# EasyEDA Pro project ProPrj_SCH_SnailCard底板_2025-01-03_23-10-43_2025-01-31.epro, schematic SnailCard 3底板
Board Name: SnailCard 3底板; Create Date: 2025-01-03; Page Name: Sheet_1; Project Name: SCH_SnailCard底板_2025-01-03_23-10-43; Schematic Name: SnailCard 3底板; Update Date: 2025-01-04; Company: 嘉立创EDA; Page Size: A2; Version: V1.0
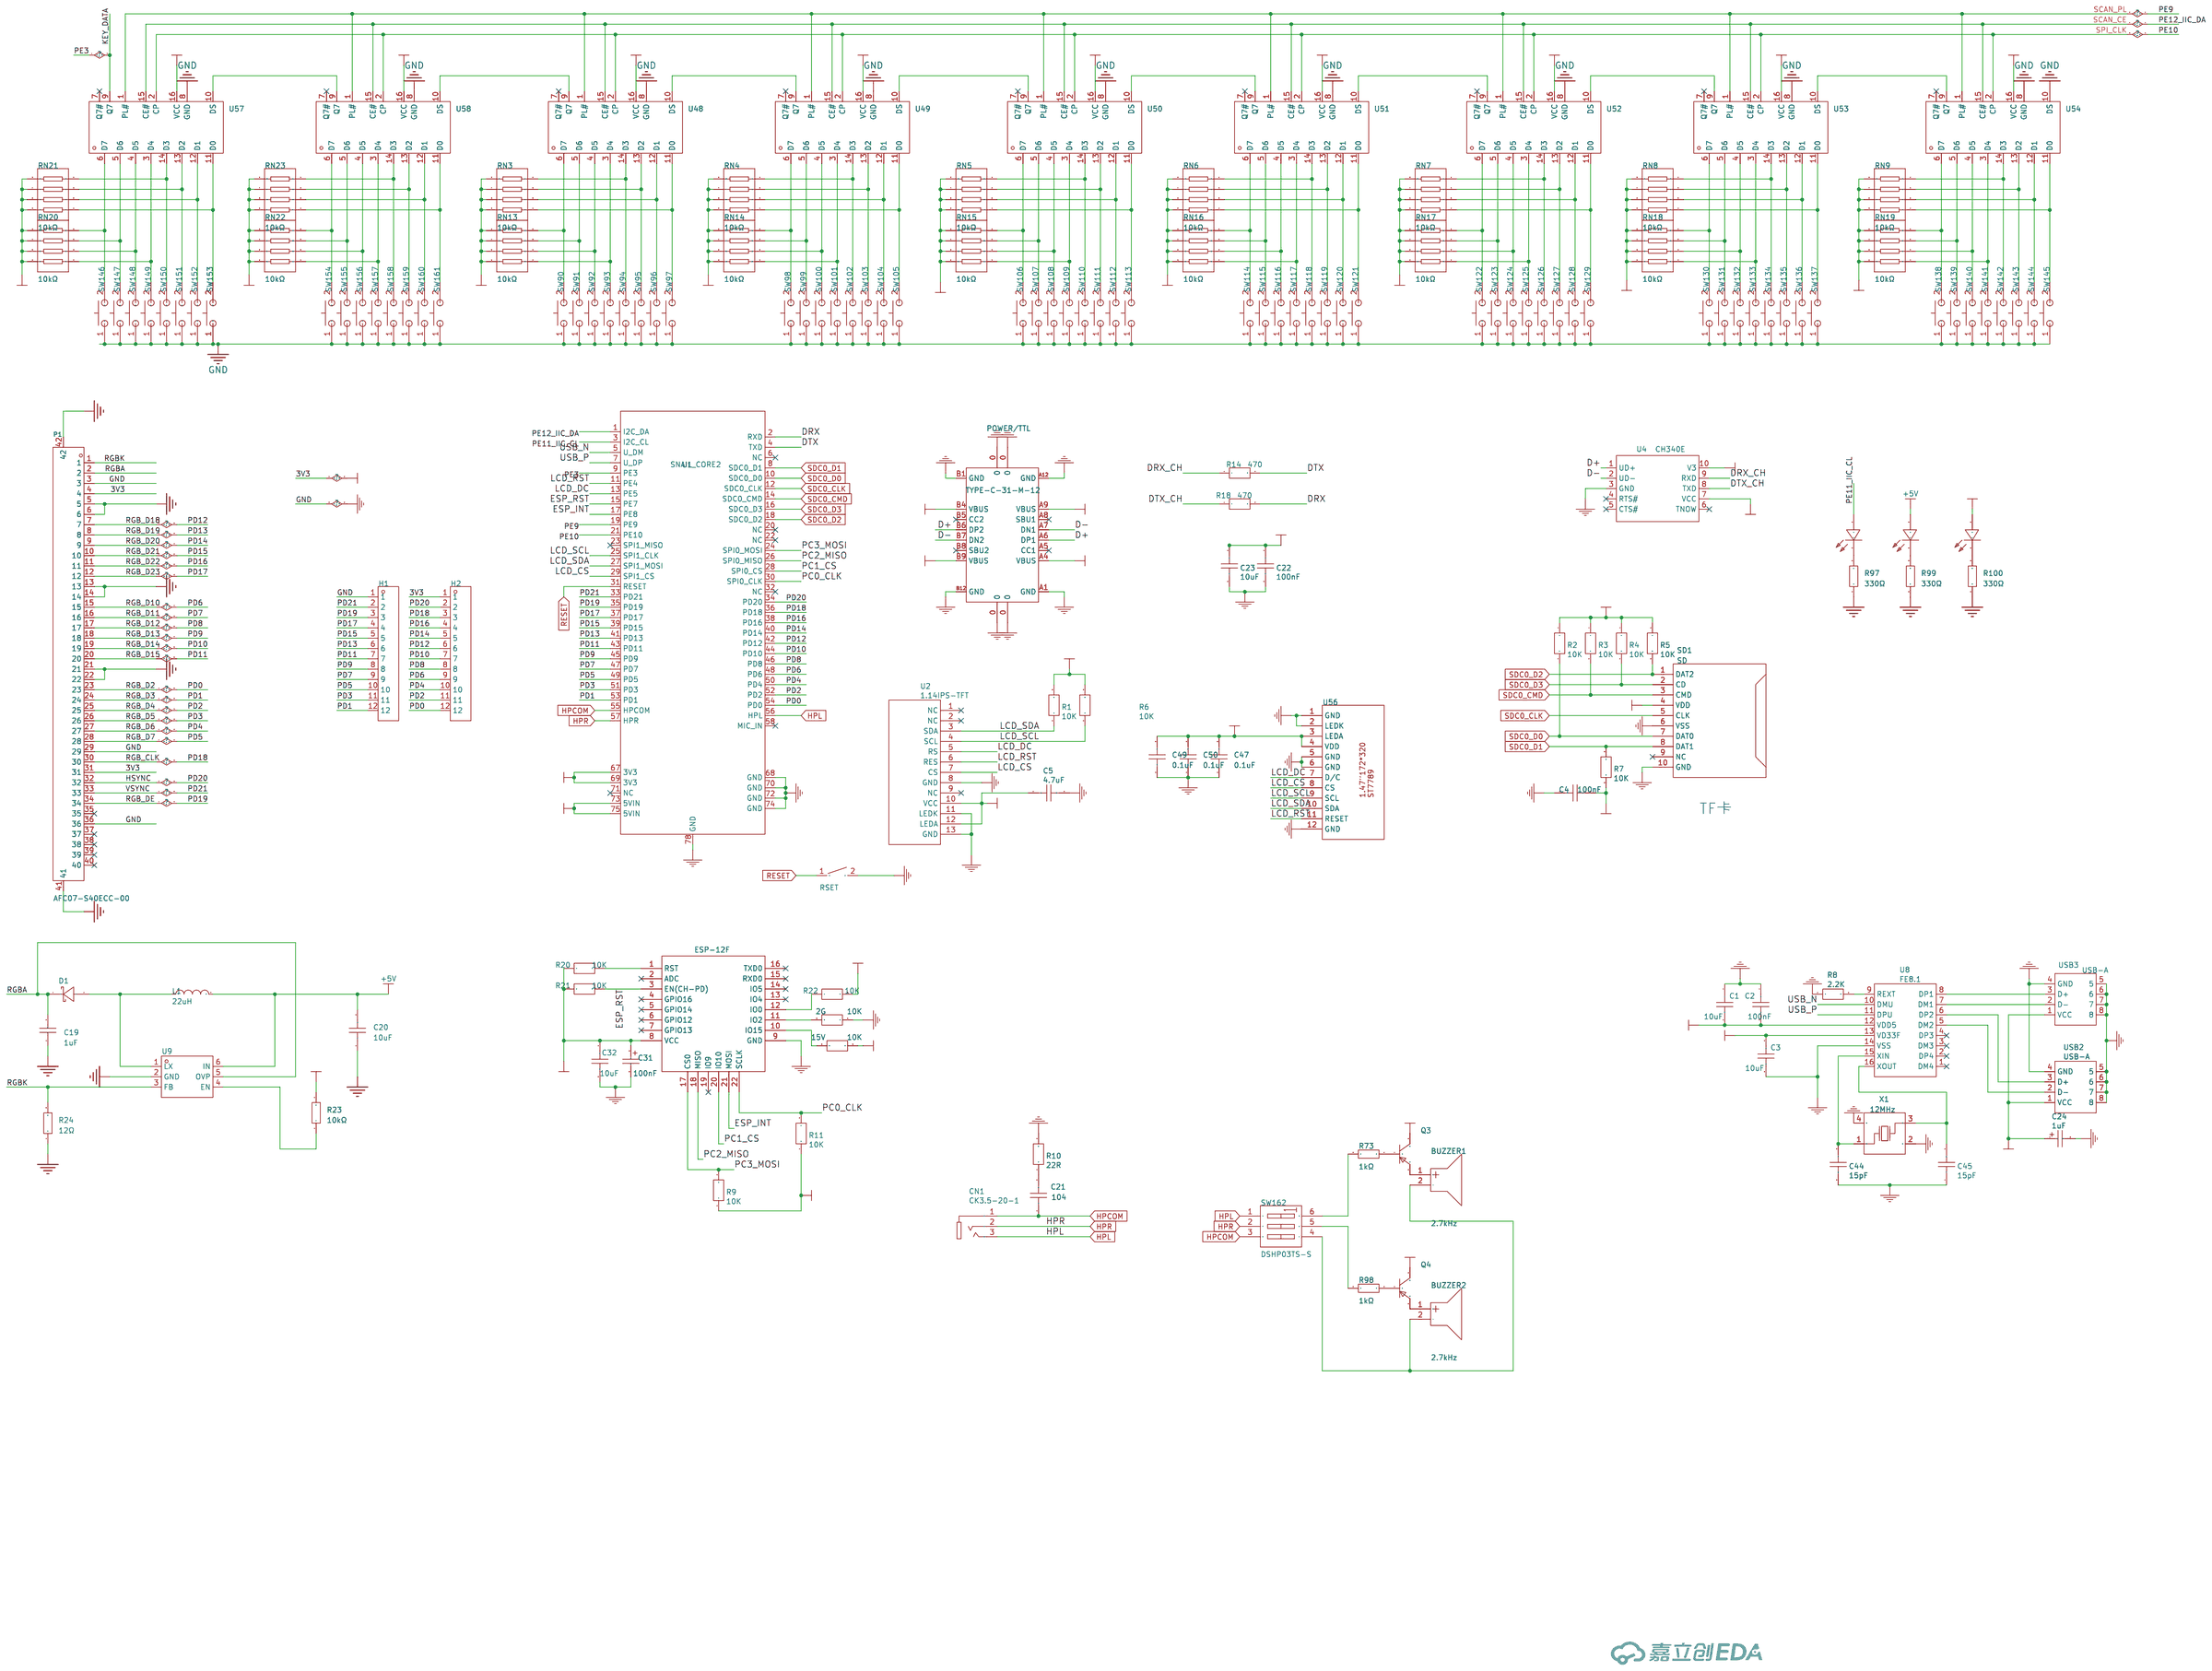
[diagram p0: schematic sheet]

## Parts
2G  10K  [R0603]
15V  10K  [R0603]
BUZZER1  2.7kHz  [BUZ-TH_BD9.0-P5.00-D0.6-FD]
BUZZER2  2.7kHz  [BUZ-TH_BD9.0-P5.00-D0.6-FD]
C1  10uF  [C0603]
C2  100nF  [C0603]
C3  10uF  [C0603]
C4  100nF  [C0603]
C5  4.7uF  [C0603]
C19  1uF  [C0603]
C20  10uF  [C0603]
C21  104  [C0603]
C22  100nF  [C0603]
C23  10uF  [C0603]
C24  1uF  [CAP-SMD_L3.5-W2.8-R-RD]
C31  100nF  [CAP-SMD_L3.5-W2.8-R-RD]
C32  10uF  [C0603]
C44  15pF  [C0603]
C45  15pF  [C0603]
C47  0.1uF  [C0603]
C49  0.1uF  [C0603]
C50  0.1uF  [C0603]
CN1  CK3.5-20-1  [AUDIO-SMD_CK3.5-20-1]
D1  -  [SMA_L4.3-W2.5-LS5.0-RD]
H1  -  [HDR-TH_12P-P2.54-V-M]
H2  -  [HDR-TH_12P-P2.54-V-M]
L1  22uH  [IND-SMD_L4.5-W4.0_SM4532]
LED96  KT-0805G  [LED0805-R-RD]
LED97  KT-0805G  [LED0805-R-RD]
LED98  KT-0805G  [LED0805-R-RD]
P1  AFC07-S40ECC-00  [CONN-SMD_AFC07-S40ECC-00]
POWER/TTL  TYPE-C-31-M-12  [USB-C_SMD-TYPE-C-31-M-12]
Q3  S8550  [SOT-23-3_L2.9-W1.3-P1.90-LS2.4-BR]
Q4  S8550  [SOT-23-3_L2.9-W1.3-P1.90-LS2.4-BR]
R1  10K  [R0603]
R2  10K  [R0603]
R3  10K  [R0603]
R4  10K  [R0603]
R5  10K  [R0603]
R6  10K  [R0603]
R7  10K  [R0603]
R8  2.2K  [R0603]
R9  10K  [R0603]
R10  22R  [R0603]
R11  10K  [R0603]
R14  470  [R0603]
R18  470  [R0603]
R20  10K  [R0603]
R21  10K  [R0603]
R22  10K  [R0603]
R23  10kΩ  [R0603]
R24  12Ω  [R0603]
R73  1kΩ  [R0603]
R97  330Ω  [R0603]
R98  1kΩ  [R0603]
R99  330Ω  [R0603]
R100  330Ω  [R0603]
RN3  10kΩ  [RES-ARRAY-SMD_0603-8P-L3.2-W1.6-BL]
RN4  10kΩ  [RES-ARRAY-SMD_0603-8P-L3.2-W1.6-BL]
RN5  10kΩ  [RES-ARRAY-SMD_0603-8P-L3.2-W1.6-BL]
RN6  10kΩ  [RES-ARRAY-SMD_0603-8P-L3.2-W1.6-BL]
RN7  10kΩ  [RES-ARRAY-SMD_0603-8P-L3.2-W1.6-BL]
RN8  10kΩ  [RES-ARRAY-SMD_0603-8P-L3.2-W1.6-BL]
RN9  10kΩ  [RES-ARRAY-SMD_0603-8P-L3.2-W1.6-BL]
RN13  10kΩ  [RES-ARRAY-SMD_0603-8P-L3.2-W1.6-BL]
RN14  10kΩ  [RES-ARRAY-SMD_0603-8P-L3.2-W1.6-BL]
RN15  10kΩ  [RES-ARRAY-SMD_0603-8P-L3.2-W1.6-BL]
RN16  10kΩ  [RES-ARRAY-SMD_0603-8P-L3.2-W1.6-BL]
RN17  10kΩ  [RES-ARRAY-SMD_0603-8P-L3.2-W1.6-BL]
RN18  10kΩ  [RES-ARRAY-SMD_0603-8P-L3.2-W1.6-BL]
RN19  10kΩ  [RES-ARRAY-SMD_0603-8P-L3.2-W1.6-BL]
RN20  10kΩ  [RES-ARRAY-SMD_0603-8P-L3.2-W1.6-BL]
RN21  10kΩ  [RES-ARRAY-SMD_0603-8P-L3.2-W1.6-BL]
RN22  10kΩ  [RES-ARRAY-SMD_0603-8P-L3.2-W1.6-BL]
RN23  10kΩ  [RES-ARRAY-SMD_0603-8P-L3.2-W1.6-BL]
RSET  ST-1185S  [SW-SMD_ST-1185S]
SD1  SD  [TF-SMD_TF-115K]
SW90  -  [SW-SMD_L3.9-W2.9-P4.15-LS5.0]
SW91  -  [SW-SMD_L3.9-W2.9-P4.15-LS5.0]
SW92  -  [SW-SMD_L3.9-W2.9-P4.15-LS5.0]
SW93  -  [SW-SMD_L3.9-W2.9-P4.15-LS5.0]
SW94  -  [SW-SMD_L3.9-W2.9-P4.15-LS5.0]
SW95  -  [SW-SMD_L3.9-W2.9-P4.15-LS5.0]
SW96  -  [SW-SMD_L3.9-W2.9-P4.15-LS5.0]
SW97  -  [SW-SMD_L3.9-W2.9-P4.15-LS5.0]
SW98  -  [SW-SMD_L3.9-W2.9-P4.15-LS5.0]
SW99  -  [SW-SMD_L3.9-W2.9-P4.15-LS5.0]
SW100  -  [SW-SMD_L3.9-W2.9-P4.15-LS5.0]
SW101  -  [SW-SMD_L3.9-W2.9-P4.15-LS5.0]
SW102  -  [SW-SMD_L3.9-W2.9-P4.15-LS5.0]
SW103  -  [SW-SMD_L3.9-W2.9-P4.15-LS5.0]
SW104  -  [SW-SMD_L3.9-W2.9-P4.15-LS5.0]
SW105  -  [SW-SMD_L3.9-W2.9-P4.15-LS5.0]
SW106  -  [SW-SMD_L3.9-W2.9-P4.15-LS5.0]
SW107  -  [SW-SMD_L3.9-W2.9-P4.15-LS5.0]
SW108  -  [SW-SMD_L3.9-W2.9-P4.15-LS5.0]
SW109  -  [SW-SMD_L3.9-W2.9-P4.15-LS5.0]
SW110  -  [SW-SMD_L3.9-W2.9-P4.15-LS5.0]
SW111  -  [SW-SMD_L3.9-W2.9-P4.15-LS5.0]
SW112  -  [SW-SMD_L3.9-W2.9-P4.15-LS5.0]
SW113  -  [SW-SMD_L3.9-W2.9-P4.15-LS5.0]
SW114  -  [SW-SMD_L3.9-W2.9-P4.15-LS5.0]
SW115  -  [SW-SMD_L3.9-W2.9-P4.15-LS5.0]
SW116  -  [SW-SMD_L3.9-W2.9-P4.15-LS5.0]
SW117  -  [SW-SMD_L3.9-W2.9-P4.15-LS5.0]
SW118  -  [SW-SMD_L3.9-W2.9-P4.15-LS5.0]
SW119  -  [SW-SMD_L3.9-W2.9-P4.15-LS5.0]
SW120  -  [SW-SMD_L3.9-W2.9-P4.15-LS5.0]
SW121  -  [SW-SMD_L3.9-W2.9-P4.15-LS5.0]
SW122  -  [SW-SMD_L3.9-W2.9-P4.15-LS5.0]
SW123  -  [SW-SMD_L3.9-W2.9-P4.15-LS5.0]
SW124  -  [SW-SMD_L3.9-W2.9-P4.15-LS5.0]
SW125  -  [SW-SMD_L3.9-W2.9-P4.15-LS5.0]
SW126  -  [SW-SMD_L3.9-W2.9-P4.15-LS5.0]
SW127  -  [SW-SMD_L3.9-W2.9-P4.15-LS5.0]
SW128  -  [SW-SMD_L3.9-W2.9-P4.15-LS5.0]
SW129  -  [SW-SMD_L3.9-W2.9-P4.15-LS5.0]
SW130  -  [SW-SMD_L3.9-W2.9-P4.15-LS5.0]
SW131  -  [SW-SMD_L3.9-W2.9-P4.15-LS5.0]
SW132  -  [SW-SMD_L3.9-W2.9-P4.15-LS5.0]
SW133  -  [SW-SMD_L3.9-W2.9-P4.15-LS5.0]
SW134  -  [SW-SMD_L3.9-W2.9-P4.15-LS5.0]
SW135  -  [SW-SMD_L3.9-W2.9-P4.15-LS5.0]
SW136  -  [SW-SMD_L3.9-W2.9-P4.15-LS5.0]
SW137  -  [SW-SMD_L3.9-W2.9-P4.15-LS5.0]
SW138  -  [SW-SMD_L3.9-W2.9-P4.15-LS5.0]
SW139  -  [SW-SMD_L3.9-W2.9-P4.15-LS5.0]
SW140  -  [SW-SMD_L3.9-W2.9-P4.15-LS5.0]
SW141  -  [SW-SMD_L3.9-W2.9-P4.15-LS5.0]
SW142  -  [SW-SMD_L3.9-W2.9-P4.15-LS5.0]
SW143  -  [SW-SMD_L3.9-W2.9-P4.15-LS5.0]
SW144  -  [SW-SMD_L3.9-W2.9-P4.15-LS5.0]
SW145  -  [SW-SMD_L3.9-W2.9-P4.15-LS5.0]
SW146  -  [SW-SMD_L3.9-W2.9-P4.15-LS5.0]
SW147  -  [SW-SMD_L3.9-W2.9-P4.15-LS5.0]
SW148  -  [SW-SMD_L3.9-W2.9-P4.15-LS5.0]
SW149  -  [SW-SMD_L3.9-W2.9-P4.15-LS5.0]
SW150  -  [SW-SMD_L3.9-W2.9-P4.15-LS5.0]
SW151  -  [SW-SMD_L3.9-W2.9-P4.15-LS5.0]
SW152  -  [SW-SMD_L3.9-W2.9-P4.15-LS5.0]
SW153  -  [SW-SMD_L3.9-W2.9-P4.15-LS5.0]
SW154  -  [SW-SMD_L3.9-W2.9-P4.15-LS5.0]
SW155  -  [SW-SMD_L3.9-W2.9-P4.15-LS5.0]
SW156  -  [SW-SMD_L3.9-W2.9-P4.15-LS5.0]
SW157  -  [SW-SMD_L3.9-W2.9-P4.15-LS5.0]
SW158  -  [SW-SMD_L3.9-W2.9-P4.15-LS5.0]
SW159  -  [SW-SMD_L3.9-W2.9-P4.15-LS5.0]
SW160  -  [SW-SMD_L3.9-W2.9-P4.15-LS5.0]
SW161  -  [SW-SMD_L3.9-W2.9-P4.15-LS5.0]
SW162  DSHP03TS-S  [SW-SMD_DSHP03TS-S]
U1  SNAIL_CORE2  [SNAIL_CORE2]
U2  1.14IPS-TFT  [1.14IPS]
U3  ESP-12F  [WIFIM-SMD_ESP-12F-ESP8266MOD]
U4  CH340E  [MSOP-10_L3.0-W3.0-P0.50-LS5.0-BL]
U8  FE8.1  [SSOP-16_L4.9-W3.9-P0.64-LS6.0-BL]
U9  RY3730  [SOT-23-6_L2.9-W1.6-P0.95-LS2.8-BL]
U48  -  [SOIC-16_L9.9-W3.9-P1.27-LS6.0-BL]
U49  -  [SOIC-16_L9.9-W3.9-P1.27-LS6.0-BL]
U50  -  [SOIC-16_L9.9-W3.9-P1.27-LS6.0-BL]
U51  -  [SOIC-16_L9.9-W3.9-P1.27-LS6.0-BL]
U52  -  [SOIC-16_L9.9-W3.9-P1.27-LS6.0-BL]
U53  -  [SOIC-16_L9.9-W3.9-P1.27-LS6.0-BL]
U54  -  [SOIC-16_L9.9-W3.9-P1.27-LS6.0-BL]
U56  -  [1.47''173*320 ST7789]
U57  -  [SOIC-16_L9.9-W3.9-P1.27-LS6.0-BL]
U58  -  [SOIC-16_L9.9-W3.9-P1.27-LS6.0-BL]
USB2  USB-A  [USB-A]
USB3  USB-A  [USB-A]
X1  12MHz  [OSC-SMD_4P-L3.2-W2.5-BL]

## Library data of the parts
2G 15V R1-R7 R9 R11 R20-R22 = 10K: Supplier: LCSC; Supplier Part: C465746; Manufacturer: PANASONIC; Manufacturer Part: ERA3ARB103V; JLCPCB Part Class: Extended Part
BUZZER1 BUZZER2 = GMD0955YB-3V2700: 驱动方式:有源(内含驱动线路);构造类型:电磁式;频率:2.7kHz;声压(SPL):80dB@3V,10cm;; Supplier Part: C252933; Manufacturer: INGHAi(赢海); JLCPCB Part Class: Extended Part; Datasheet: https://atta.szlcsc.com/upload/public/pdf/source/20200113/C252933_0808B968C54230937A04AB87C18560D6.pdf; Supplier: LCSC; Oscillator Circuit: 有源(内含驱动线路); Technology Type: 电磁式; Operating Voltage: 2V~5V; Sound Pressure Level (SPL): 80dB@3V,10cm; Diameter (φD): 9mm; Height: 5.5mm
C1 C3 C23 C32 = 10uF: Supplier: LCSC; Supplier Part: C524952; Manufacturer: Taiyo Yuden; Manufacturer Part: AMK107BJ106MA-T
C2 C4 C22 = 100nF: Supplier: LCSC; Supplier Part: C524952; Manufacturer: Taiyo Yuden; Manufacturer Part: AMK107BJ106MA-T
C5 C47 C49 C50 = 4.7uF: Supplier: LCSC; Supplier Part: C524952; Manufacturer: Taiyo Yuden; Manufacturer Part: AMK107BJ106MA-T
C19 = CL10A105KB8NNNC: 容值:1uF;精度:±10%;额定电压:50V;材质(温度系数):X5R;; LCSC Part Name: 1uF ±10% 50V; Supplier Part: C15849; Manufacturer: SAMSUNG(三星); Supplier Footprint: 0603; JLCPCB Part Class: Basic Part; Datasheet: https://atta.szlcsc.com/upload/public/pdf/source/20160103/1457707679084.pdf; Supplier: LCSC; Tolerance: ±10%; Voltage Rated: 50V; Temperature Coefficient: X5R
C20 = CL10A106KP8NNNC: 容值:10uF;精度:±10%;额定电压:10V;材质(温度系数):X5R;; LCSC Part Name: 10uF ±10% 10V; Supplier Part: C19702; Manufacturer: SAMSUNG(三星); Supplier Footprint: 0603; JLCPCB Part Class: Basic Part; Datasheet: https://atta.szlcsc.com/upload/public/pdf/source/20160103/1457707703378.pdf; Supplier: LCSC; Tolerance: ±10%; Voltage Rated: 10V; Temperature Coefficient: X5R
C21 = 104
C24 = 1uF: Supplier: LCSC; Manufacturer: AVX; Manufacturer Part: TAJB105K035RNJ; Supplier Part: C7192; JLCPCB Part Class: Extend; JLCPCB SMD: Yes
C31 = 100nF: Supplier: LCSC; Manufacturer: AVX; Manufacturer Part: TAJB105K035RNJ; Supplier Part: C7192; JLCPCB Part Class: Extend; JLCPCB SMD: Yes
C44 C45 = 15pF
CN1 = CK3.5-20-1: Supplier: LCSC; Supplier Part: C718046; Manufacturer: JINJIA
D1 = SS34: 二极管配置:独立式;直流反向耐压(Vr):45V;平均整流电流(Io):3A;正向压降(Vf):550mV@3A;反向电流(Ir):500A@45V;; LCSC Part Name: 45V 3A 550mV@3A; Supplier Part: C2900685; Manufacturer: BLUE ROCKET(蓝箭); Supplier Footprint: SMA; JLCPCB Part Class: Extended Part; Datasheet: https://atta.szlcsc.com/upload/public/pdf/source/20211019/D690381062792463711EAF5143529E57.pdf; Supplier: LCSC; Diode Configuration: 独立式; Reverse Voltage (Vr): 45V; Average Rectified Current (Io): 3A; Forward Voltage (Vf@If): 550mV@3A; Reverse Leakage Current (Ir): 500A@45V
H1 H2 = HDR-M_2.54_1x12P: 间距:2.54mm;总PIN位数:12;排数:1;插针结构:1x12P;行距:-;安装类型:直插;圆针/方针:方针;额定电流:3A;额定电压:250V;配合针长度:6mm;塑高:2.5mm;端接针长度:3mm;触头材质:-;工作温度范围:-40℃~+105℃;颜色:黑色;; Supplier Part: C2840012; Supplier Footprint: 插件
L1 = GCD43-220MC: 电感值:22uH;精度:±20%;额定电流:1A;直流电阻(DCR):375mΩ;; LCSC Part Name: 22uH ±20% 1A 375mΩ; Supplier Part: C439244; Manufacturer: GLE(格莱尔); Supplier Footprint: SMD; JLCPCB Part Class: Extended Part; Datasheet: https://atta.szlcsc.com/upload/public/pdf/source/20191226/C439244_68427D11A7C3652EC048C5CEB2B3AA76.pdf; Supplier: LCSC; Tolerance: ±20%; Rated Current: 1A; DC Resistance (DCR): 375mΩ
LED96-LED98 = KT-0805G: 灯头类型:-;发光颜色:翠绿色;正向电压(VF):-;功率:-;正向电流:-;主波长:-;二极管配置:-;透镜颜色:-;色温:-;发光强度:-;发光角度:-;载带方式:-;工作温度:-;; LCSC Part Name: 0805 翠绿 高亮; Supplier Part: C2297; Manufacturer: KENTO; Supplier Footprint: 0805; JLCPCB Part Class: 基础库; Datasheet: https://atta.szlcsc.com/upload/public/pdf/source/20170209/1486607340485.pdf; Supplier: LCSC; Emitted Color: 翠绿色
P1 = AFC07-S40ECC-00: 间距:0.5mm;触点数量:40P;锁定特性:抽屉式;安装类型:卧贴;触点类型:上接;; LCSC Part Name: 0.5mm P数:40P 抽屉式 上接; Supplier Part: C11097; Manufacturer: JS(钜硕电子); Supplier Footprint: SMD,P=0.5mm; JLCPCB Part Class: Extended Part; Datasheet: https://atta.szlcsc.com/upload/public/pdf/source/20130129/1457706582878.pdf; Supplier: LCSC; Pitch: 0.5mm; Number of Contacts: 40P; Locking Feature: 抽屉式; Mounting Type: 卧贴; Contact Type: 上接; Height Above Board: 2mm; FFC, FCB Thickness: 0.3mm
POWER/TTL = TYPE-C-31-M-12: Supplier: LCSC; Supplier Part: C165948; Manufacturer: Rectangular Connectors - Contacts
Q3 Q4 = S8550_C2891805: Supplier Part: C2891805; Manufacturer: YONGYUTAI(永裕泰); Supplier Footprint: SOT-23; JLCPCB Part Class: 扩展库; Datasheet: https://atta.szlcsc.com/upload/public/pdf/source/20210901/65C3C4D1695A9271DEFEFE0B623CB3B1.pdf; Supplier: LCSC
R8 = 2.2K: Supplier: LCSC; Supplier Part: C465746; Manufacturer: PANASONIC; Manufacturer Part: ERA3ARB103V; JLCPCB Part Class: Extended Part
R10 = 22R
R14 R18 = 470: Supplier: LCSC; Supplier Part: C465746; Manufacturer: PANASONIC; Manufacturer Part: ERA3ARB103V; JLCPCB Part Class: Extended Part
R23 = 0603WAF1002T5E: 阻值:10kΩ;精度:±1%;功率:100mW;温度系数:±100ppm/℃;电阻类型:厚膜电阻;; LCSC Part Name: 10kΩ ±1% 100mW 厚膜电阻; Supplier Part: C25804; Manufacturer: UNI-ROYAL(厚声); Supplier Footprint: 0603; JLCPCB Part Class: Basic Part; Datasheet: https://atta.szlcsc.com/upload/public/pdf/source/20200306/C422600_1E6D84923E4A46A82E41ADD87F860B5C.pdf; Supplier: LCSC; Tolerance: ±1%; Power(Watts): 100mW; Overload Voltage (Max): 75V; Temperature Coefficient: ±100ppm/℃; Type: 厚膜电阻; Operating Temperature Range: -55℃~+155℃
R24 = RS-03K12R0FT: 阻值:12Ω;精度:±1%;功率:100mW;温度系数:±100ppm/℃;; LCSC Part Name: 12Ω ±1% 100mW; Supplier Part: C310268; Manufacturer: FH(风华); Supplier Footprint: 0603; JLCPCB Part Class: Extended Part; Datasheet: https://atta.szlcsc.com/upload/public/pdf/source/20180927/C310268_81D91F4EFBEFB660CE5EA636240332E4.pdf; Supplier: LCSC; Tolerance: ±1%; Power(Watts): 100mW; Temperature Coefficient: ±100ppm/℃; Overload Voltage (Max): 50V; Operating Temperature Range: -55℃~+155℃
R73 R98 = 0603WAF1001T5E: 电阻类型:厚膜电阻;阻值:1kΩ;精度:±1%;功率:100mW;; LCSC Part Name: 1kΩ ±1% 100mW; Supplier Part: C21190; Manufacturer: UNI-ROYAL(厚声); Supplier Footprint: 0603; JLCPCB Part Class: Basic Part; Datasheet: https://atta.szlcsc.com/upload/public/pdf/source/20200306/C422600_1E6D84923E4A46A82E41ADD87F860B5C.pdf; Supplier: LCSC; Type: 厚膜电阻; Tolerance: ±1%; Power(Watts): 100mW; Temperature Coefficient: ±100ppm/℃; Overload Voltage (Max): 75V; Operating Temperature Range: -55℃~+155℃
R97 R99 R100 = 0603WAF3300T5E: 电阻类型:厚膜电阻;阻值:330Ω;精度:±1%;功率:100mW;最大工作电压:75V;温度系数:±100ppm/℃;; LCSC Part Name: 330Ω ±1% 100mW 厚膜电阻; Supplier Part: C23138; Manufacturer: UNI-ROYAL(厚声); Supplier Footprint: 0603; JLCPCB Part Class: 基础库; Datasheet: https://atta.szlcsc.com/upload/public/pdf/source/20200306/C422600_1E6D84923E4A46A82E41ADD87F860B5C.pdf; Supplier: LCSC; Type: 厚膜电阻; Tolerance: ±1%; Power(Watts): 100mW; Overload Voltage (Max): 75V; Temperature Coefficient: ±100ppm/℃; Operating Temperature Range: -55℃~+155℃
RN3-RN9 RN13-RN23 = 4D03WGJ0103T5E: 阻值:10kΩ;精度:±5%;单个元件功率:62.5mW;温度系数:±200ppm/;电阻器数:4;引脚数:8;; LCSC Part Name: 10kΩ ±5%; Supplier Part: C29718; Manufacturer: UNI-ROYAL(厚声); Supplier Footprint: 0603x4; Datasheet: https://atta.szlcsc.com/upload/public/pdf/source/20170615/1497511005633.pdf; Supplier: LCSC; Tolerance: ±5%; Power(Watts): 62.5mW; Temperature Coefficient: ±200ppm/; Number of Resistors: 4; Number of Pins: 8
RSET = ST-1185S: Supplier: LCSC; Supplier Part: C589191; Manufacturer: RI SHENG; JLCPCB Part Class: Extended Part
SD1 = SD
SW90-SW161 = GT-TC029B-H025-L1N: 触点电流:50mA;额定电压(DC):12V;绝缘电阻:100MΩ;电路结构:单刀单掷;安装方式:立贴;按钮形状:圆形按钮;按钮/盖帽颜色:黑色;带灯:无;作用力:250gf@±30gf;机械寿命:100000;工作温度:-30℃~+85℃;引脚样式:SMD接片;开关长度:3.9mm;开关宽度:2.9mm;开关高度:2.5mm;带支架:否;; LCSC Part Name: 立式两脚小龟H2.5 250gf 无柱; Supplier Part: C843669; Manufacturer: G-Switch(品赞); Supplier Footprint: SMD,3×4×2.5mm; JLCPCB Part Class: Extended Part; Datasheet: https://atta.szlcsc.com/upload/public/pdf/source/20201014/C843665_B07D254A2E90B746498E934B945CCD5F.pdf; Supplier: LCSC; Contact Current: 50mA; Voltage Rating (DC): 12V; Insulation Resistance: 100MΩ; Circuit: 单刀单掷; Mounting Style: 立贴; Actuator Style: 圆形按钮; Actuator/Cap Color: 黑色; With Lamp: 无; Operating Force: 250gf@±30gf; Mechanical Life: 100000; Operating Temperature: -30℃~+85℃; Pin Style: SMD接片; Switch Length: 3.9mm; Switch Width: 2.9mm; Switch Height: 2.5mm; Strike Gundam: 否
SW162 = DSHP03TS-S: 类型:平拨,凹槽式;电路结构:单刀单掷;开关位数:3位;额定电流:25mA;额定电压:24V;使用寿命:3千次;颜色:黑色;; LCSC Part Name: 间距1.27mm 平拨,凹槽式 3位拨码开关; Supplier Part: C319051; Manufacturer: XKB Connectivity(中国星坤); Supplier Footprint: SMD-6P,5.4x5.4mm; JLCPCB Part Class: Extended Part; Datasheet: https://atta.szlcsc.com/upload/public/pdf/source/20211009/11BE85C99D2C85B0991AF4F9D6EB8BDE.pdf; Supplier: LCSC; Type: 平拨,凹槽式; Circuit: 单刀单掷; Number of Positions: 3位; Pin Style: 鸥翼型; Lead Pitch: 1.27mm; Current Rating: 25mA; Voltage Rating: 24V; Operating Temperature: -20℃~+70℃; Operating Life: 3千次; Color: 黑色
U1 = SNAIL_CORE2
U2 = 1.14IPS-TFT
U3 = ESP-12F: Supplier: LCSC; Manufacturer: Ai-Thinker; Manufacturer Part: ESP-12F(ESP8266MOD); Supplier Part: C82891
U4 = CH340E: Supplier: LCSC; Manufacturer: WCH; Supplier Part: C99652; JLCPCB Part Class: Extend
U8 = FE8.1: Manufacturer: terminus-usa; Manufacturer Part: FE8.1-FSOP16A; link: https://terminus-usa.com/product/fe8-1-usb2-0-high-speed-4-port-hub-controller/
U9 = RY3730: LCSC Part Name: RY3730 WLED Driver, 2.5-5.5V, 8Series WLED Driver, 1.2MHz, SOT23-6; Supplier Part: C370887; Manufacturer: RYCHiP(蕊源); Supplier Footprint: SOT-23-6; JLCPCB Part Class: Extended Part; Datasheet: https://atta.szlcsc.com/upload/public/pdf/source/20190329/C370887_F149D316440A2ABDFE08FA1E0696DEE8.pdf; Supplier: LCSC
U48-U54 U57 U58 = 74HC165D,653: Supplier Part: C5613; Manufacturer: Nexperia(安世); Supplier Footprint: SOIC-16_150mil; Datasheet: https://atta.szlcsc.com/upload/public/pdf/source/20160218/1457707760975.pdf; Supplier: LCSC
U56 = 1.47寸172*320LCD串口屏ST7789
USB2 USB3 = USB-A: Supplier: LCSC; Supplier Part: C42531; Manufacturer: LCSC; Manufacturer Part: USB-AF-SMD-12.8X10-H5.7; JLCPCB Part Class: Extended Part
X1 = 12MHz: Supplier: LCSC; Supplier Part: C164053; Manufacturer: Zhejiang Abel Elec; Manufacturer Part: SMD-3225_4P27.12MHZ20PF10PPM-40~+85℃; JLCPCB Part Class: Extend; JLCPCB SMD: Yes

## Nets
+3V3: 15V.1 C3.1 C4.1 C5.1 C31.1 C32.1 C47.2 C49.2 C50.2 H2.1 LED98.1(A) P1.4 P1.31 Q3.3(C) Q4.3(C) R1.2 R2.1 R3.1 R4.1 R5.1 R6.2 R7.2 R9.1 R11.1 R20.1 R21.1 R22.2 R23.2 RN3.5 RN3.6 RN3.7 RN3.8 RN4.5 RN4.6 RN4.7 RN4.8 RN5.5 RN5.6 RN5.7 RN5.8 RN6.5 RN6.6 RN6.7 RN6.8 RN7.5 RN7.6 RN7.7 RN7.8 RN8.5 RN8.6 RN8.7 RN8.8 RN9.5 RN9.6 RN9.7 RN9.8 RN13.5 RN13.6 RN13.7 RN13.8 RN14.5 RN14.6 RN14.7 RN14.8 RN15.5 RN15.6 RN15.7 RN15.8 RN16.5 RN16.6 RN16.7 RN16.8 RN17.5 RN17.6 RN17.7 RN17.8 RN18.5 RN18.6 RN18.7 RN18.8 RN19.5 RN19.6 RN19.7 RN19.8 RN20.5 RN20.6 RN20.7 RN20.8 RN21.5 RN21.6 RN21.7 RN21.8 RN22.5 RN22.6 RN22.7 RN22.8 RN23.5 RN23.6 RN23.7 RN23.8 SD1.4(VDD) U1.67(3V3) U1.69(3V3) U2.10(VCC) U2.12(LEDA) U3.8(VCC) U4.10(V3) U8.13(VD33F) U48.16(VCC) U49.16(VCC) U50.16(VCC) U51.16(VCC) U52.16(VCC) U53.16(VCC) U54.16(VCC) U56.3(LEDA) U56.4(VDD) U57.16(VCC) U58.16(VCC)
+5V: C1.2 C2.2 C20.2 C22.1 C23.1 C24.1 L1.2 LED97.1(A) POWER/TTL.A4(VBUS) POWER/TTL.A9(VBUS) POWER/TTL.B4(VBUS) POWER/TTL.B9(VBUS) U1.73(5VIN) U1.75(5VIN) U4.7(VCC) U8.12(VDD5) U9.6(IN) USB2.1(VCC) USB3.1(VCC)
GND: 2G.1 C1.1 C2.1 C3.2 C4.2 C5.2 C19.1 C20.1 C22.2 C23.2 C24.2 C31.2 C32.2 C44.1 C45.1 C47.1 C49.1 C50.1 H1.1 P1.3 P1.5 P1.6 P1.13 P1.14 P1.21 P1.22 P1.29 P1.36 P1.41 P1.42 POWER/TTL.0 POWER/TTL.A1(GND) POWER/TTL.A12(GND) POWER/TTL.B1(GND) POWER/TTL.B12(GND) R8.1 R10.2 R24.1 R97.1 R99.1 R100.1 RSET.2 SD1.6(VSS) SD1.10(GND) SW90.1 SW91.1 SW92.1 SW93.1 SW94.1 SW95.1 SW96.1 SW97.1 SW98.1 SW99.1 SW100.1 SW101.1 SW102.1 SW103.1 SW104.1 SW105.1 SW106.1 SW107.1 SW108.1 SW109.1 SW110.1 SW111.1 SW112.1 SW113.1 SW114.1 SW115.1 SW116.1 SW117.1 SW118.1 SW119.1 SW120.1 SW121.1 SW122.1 SW123.1 SW124.1 SW125.1 SW126.1 SW127.1 SW128.1 SW129.1 SW130.1 SW131.1 SW132.1 SW133.1 SW134.1 SW135.1 SW136.1 SW137.1 SW138.1 SW139.1 SW140.1 SW141.1 SW142.1 SW143.1 SW144.1 SW145.1 SW146.1 SW147.1 SW148.1 SW149.1 SW150.1 SW151.1 SW152.1 SW153.1 SW154.1 SW155.1 SW156.1 SW157.1 SW158.1 SW159.1 SW160.1 SW161.1 U1.68(GND) U1.70(GND) U1.72(GND) U1.74(GND) U1.78(GND) U2.8(GND) U2.11(LEDK) U2.13(GND) U3.9(GND) U4.3(GND) U8.14(VSS) U9.2(GND) U48.8(GND) U49.8(GND) U50.8(GND) U51.8(GND) U52.8(GND) U53.8(GND) U54.8(GND) U54.10(DS) U56.1(GND) U56.2(LEDK) U56.5(GND) U56.6(GND) U56.12(GND) U57.8(GND) U58.8(GND) USB2.4(GND) USB2.5 USB2.6 USB2.7 USB2.8 USB3.4(GND) USB3.5 USB3.6 USB3.7 USB3.8 X1.2(GND) X1.4(GND)
D+: POWER/TTL.A6(DP1) POWER/TTL.B6(DP2) U4.1(UD+)
D-: POWER/TTL.A7(DN1) POWER/TTL.B7(DN2) U4.2(UD-)
DRX: R18.2 U1.2(RXD)
DRX_CH: R14.1 U4.9(RXD)
DTX: R14.2 U1.4(TXD)
DTX_CH: R18.1 U4.8(TXD)
ESP_INT: U1.17(PE8) U3.21(MOSI)
ESP_RST: R21.2 U1.15(PE7) U3.3(EN(CH-PD))
HPCOM: C21.1 CN1.1 SW162.3 U1.55(HPCOM)
HPL: CN1.3 SW162.1 U1.56(HPL)
HPR: CN1.2 SW162.2 U1.57(HPR)
HSYNC: H2.2 P1.32 U1.34(PD20)
KEY_DATA: U1.9(PE3) U57.9(Q7)
LCD_CS: U1.29(SPI1_CS) U2.7(CS) U56.8(CS)
LCD_DC: U1.13(PE5) U2.5(RS) U56.7(D/C)
LCD_RST: U1.11(PE4) U2.6(RES) U56.11(RESET)
LCD_SCL: R6.1 U1.25(SPI1_CLK) U2.4(SCL) U56.9(SCL)
LCD_SDA: R1.1 U1.27(SPI1_MOSI) U2.3(SDA) U56.10(SDA)
PC0_CLK: R11.2 U1.30(SPI0_CLK) U3.22(SCLK)
PC1_CS: U1.28(SPI0_CS) U3.20(IO10)
PC2_MISO: U1.26(SPI0_MISO) U3.18(MISO)
PC3_MOSI: R9.2 U1.24(SPI0_MOSI) U3.17(CS0)
PD0: H2.12 P1.23 U1.54(PD0)
PD1: H1.12 P1.24 U1.53(PD1)
PD2: H2.11 P1.25 U1.52(PD2)
PD3: H1.11 P1.26 U1.51(PD3)
PD4: H2.10 P1.27 U1.50(PD4)
PD5: H1.10 P1.28 U1.49(PD5)
PD6: H2.9 P1.15 U1.48(PD6)
PD7: H1.9 P1.16 U1.47(PD7)
PD8: H2.8 P1.17 U1.46(PD8)
PD9: H1.8 P1.18 U1.45(PD9)
PD10: H2.7 P1.19 U1.44(PD10)
PD11: H1.7 P1.20 U1.43(PD11)
PD12: H2.6 P1.7 U1.42(PD12)
PD13: H1.6 P1.8 U1.41(PD13)
PD14: H2.5 P1.9 U1.40(PD14)
PD15: H1.5 P1.10 U1.39(PD15)
PD16: H2.4 P1.11 U1.38(PD16)
PD17: H1.4 P1.12 U1.37(PD17)
PD18: H2.3 P1.30 U1.36(PD18)
PD19: H1.3 P1.34 U1.35(PD19)
PD21: H1.2 P1.33 U1.33(PD21)
PE9: U1.19(PE9) U48.1(PL#) U49.1(PL#) U50.1(PL#) U51.1(PL#) U52.1(PL#) U53.1(PL#) U54.1(PL#) U57.1(PL#) U58.1(PL#)
PE10: U1.21(PE10) U48.2(CP) U49.2(CP) U50.2(CP) U51.2(CP) U52.2(CP) U53.2(CP) U54.2(CP) U57.2(CP) U58.2(CP)
PE11_IIC_CL: LED96.1(A) U1.3(I2C_CL)
PE12_IIC_DA: U1.1(I2C_DA) U48.15(CE#) U49.15(CE#) U50.15(CE#) U51.15(CE#) U52.15(CE#) U53.15(CE#) U54.15(CE#) U57.15(CE#) U58.15(CE#)
RESET: RSET.1 U1.31(RESET)
RGBA: C19.2 D1.1(K) P1.2 U9.5(OVP)
RGBK: P1.1 R24.2 U9.3(FB)
SDC0_CLK: SD1.5(CLK) U1.12(SDC0_CLK)
SDC0_CMD: R3.2 SD1.3(CMD) U1.14(SDC0_CMD)
SDC0_D0: R2.2 SD1.7(DAT0) U1.10(SDC0_D0)
SDC0_D1: R7.1 SD1.8(DAT1) U1.8(SDC0_D1)
SDC0_D2: R5.2 SD1.1(DAT2) U1.18(SDC0_D2)
SDC0_D3: R4.2 SD1.2(CD) U1.16(SDC0_D3)
USB_N: U1.5(U_DM) U8.10(DMU)
USB_P: U1.7(U_DP) U8.11(DPU)
$1N68: 2G.2 U3.11(IO2)
$1N73: R22.1 U3.12(IO0)
$1N74: 15V.2 U3.10(IO15)
$1N76: R20.2 U3.1(RST)
$1N95: R8.2 U8.9(REXT)
$1N97: C45.2 U8.16(XOUT) X1.3(OSC2)
$1N98: C44.2 U8.15(XIN) X1.1(OSC1)
$1N99: U8.5(DM2) USB2.2(D-)
$1N100: U8.6(DP2) USB2.3(D+)
$1N101: U8.7(DM1) USB3.2(D-)
$1N102: U8.8(DP1) USB3.3(D+)
$1N1160: C21.2 R10.1
$1N4585: R23.1 U9.4(EN)
$1N4586: D1.2(A) L1.1 U9.1(LX)
$1N8852: RN15.1 SW106.2 U50.6(D7)
$1N8853: RN15.2 SW107.2 U50.5(D6)
$1N8854: RN15.3 SW108.2 U50.4(D5)
$1N8855: RN15.4 SW109.2 U50.3(D4)
$1N8856: RN5.4 SW113.2 U50.11(D0)
$1N8857: RN5.1 SW110.2 U50.14(D3)
$1N8858: RN5.2 SW111.2 U50.13(D2)
$1N8859: RN5.3 SW112.2 U50.12(D1)
$1N8864: RN18.1 SW130.2 U53.6(D7)
$1N8865: RN18.2 SW131.2 U53.5(D6)
$1N8866: RN18.3 SW132.2 U53.4(D5)
$1N8867: RN18.4 SW133.2 U53.3(D4)
$1N8868: RN8.4 SW137.2 U53.11(D0)
$1N8869: RN8.1 SW134.2 U53.14(D3)
$1N8870: RN8.2 SW135.2 U53.13(D2)
$1N8871: RN8.3 SW136.2 U53.12(D1)
$1N8875: RN19.1 SW138.2 U54.6(D7)
$1N8876: RN19.2 SW139.2 U54.5(D6)
$1N8877: RN19.3 SW140.2 U54.4(D5)
$1N8878: RN19.4 SW141.2 U54.3(D4)
$1N8879: RN9.1 SW142.2 U54.14(D3)
$1N8890: RN3.3 SW96.2 U48.12(D1)
$1N8891: RN3.2 SW95.2 U48.13(D2)
$1N8892: RN3.1 SW94.2 U48.14(D3)
$1N8893: RN3.4 SW97.2 U48.11(D0)
$1N8894: RN13.4 SW93.2 U48.3(D4)
$1N8895: RN13.3 SW92.2 U48.4(D5)
$1N8896: RN13.2 SW91.2 U48.5(D6)
$1N8897: RN13.1 SW90.2 U48.6(D7)
$1N8901: RN7.3 SW128.2 U52.12(D1)
$1N8902: RN7.2 SW127.2 U52.13(D2)
$1N8903: RN7.1 SW126.2 U52.14(D3)
$1N8904: RN7.4 SW129.2 U52.11(D0)
$1N8905: RN17.4 SW125.2 U52.3(D4)
$1N8906: RN17.3 SW124.2 U52.4(D5)
$1N8907: RN17.2 SW123.2 U52.5(D6)
$1N8908: RN17.1 SW122.2 U52.6(D7)
$1N8911: RN6.2 SW119.2 U51.13(D2)
$1N8912: RN6.4 SW121.2 U51.11(D0)
$1N8913: RN16.4 SW117.2 U51.3(D4)
$1N8914: RN16.2 SW115.2 U51.5(D6)
$1N8915: RN6.1 SW118.2 U51.14(D3)
$1N8916: RN6.3 SW120.2 U51.12(D1)
$1N8917: RN16.3 SW116.2 U51.4(D5)
$1N8918: RN16.1 SW114.2 U51.6(D7)
$1N8919: U48.9(Q7) U58.10(DS)
$1N8920: U48.10(DS) U49.9(Q7)
$1N8921: U49.10(DS) U50.9(Q7)
$1N8922: U50.10(DS) U51.9(Q7)
$1N8923: U51.10(DS) U52.9(Q7)
$1N8924: U52.10(DS) U53.9(Q7)
$1N8925: U53.10(DS) U54.9(Q7)
$1N8939: RN14.4 SW101.2 U49.3(D4)
$1N8940: RN14.3 SW100.2 U49.4(D5)
$1N8941: RN14.2 SW99.2 U49.5(D6)
$1N8942: RN14.1 SW98.2 U49.6(D7)
$1N8943: RN4.3 SW104.2 U49.12(D1)
$1N8944: RN4.2 SW103.2 U49.13(D2)
$1N8945: RN4.1 SW102.2 U49.14(D3)
$1N8946: RN4.4 SW105.2 U49.11(D0)
$1N8965: RN9.3 SW144.2 U54.12(D1)
$1N8982: RN9.2 SW143.2 U54.13(D2)
$1N8985: RN9.4 SW145.2 U54.11(D0)
$1N9230: LED96.2(K) R97.2
$1N14852: Q3.1(B) R73.1
$1N15047: Q4.1(B) R98.1
$1N15056: R73.2 SW162.6
$1N15061: R98.2 SW162.5
$1N16506: RN21.3 SW152.2 U57.12(D1)
$1N16507: RN21.2 SW151.2 U57.13(D2)
$1N16508: RN21.1 SW150.2 U57.14(D3)
$1N16509: RN21.4 SW153.2 U57.11(D0)
$1N16510: RN20.4 SW149.2 U57.3(D4)
$1N16511: RN20.3 SW148.2 U57.4(D5)
$1N16512: RN20.2 SW147.2 U57.5(D6)
$1N16513: RN20.1 SW146.2 U57.6(D7)
$1N16515: U57.10(DS) U58.9(Q7)
$1N16519: RN22.4 SW157.2 U58.3(D4)
$1N16520: RN22.3 SW156.2 U58.4(D5)
$1N16521: RN22.2 SW155.2 U58.5(D6)
$1N16522: RN22.1 SW154.2 U58.6(D7)
$1N16523: RN23.3 SW160.2 U58.12(D1)
$1N16524: RN23.2 SW159.2 U58.13(D2)
$1N16525: RN23.1 SW158.2 U58.14(D3)
$1N16526: RN23.4 SW161.2 U58.11(D0)
Net-(BUZZER1-1): BUZZER1.1(+) Q3.2(E)
Net-(BUZZER1-2): BUZZER1.2(-) BUZZER2.2(-) SW162.4
Net-(BUZZER2-1): BUZZER2.1(+) Q4.2(E)
Net-(LED97-2): LED97.2(K) R99.2
Net-(LED98-2): LED98.2(K) R100.2

Not connected (* = marked no-connect by the designer): P1 35* 37* 38* 39* 40*; POWER/TTL A5(CC1)* A8(SBU1)* B5(CC2)* B8(SBU2)*; SD1 9(NC)*; U1 6(NC)* 20(NC)* 22(NC)* 23(SPI1_MISO)* 32(NC)* 58(MIC_IN)* 71(NC)*; U2 1(NC)* 2(NC)* 9(NC)*; U3 2(ADC)* 4(GPIO16)* 5(GPIO14)* 6(GPIO12)* 7(GPIO13)* 13(IO4)* 14(IO5)* 15(RXD0)* 16(TXD0)* 19(IO9)*; U4 4(RTS#)* 5(CTS#)* 6(TNOW)*; U8 1(DM4)* 2(DP4)* 3(DM3)* 4(DP3)*; U48 7(Q7#)*; U49 7(Q7#)*; U50 7(Q7#)*; U51 7(Q7#)*; U52 7(Q7#)*; U53 7(Q7#)*; U54 7(Q7#)*; U57 7(Q7#)*; U58 7(Q7#)*

## Notes on the sheet
- TF卡
